# EAGLE design PCB Design (EAGLE 8.6.3)

## Sheet 1 of 3
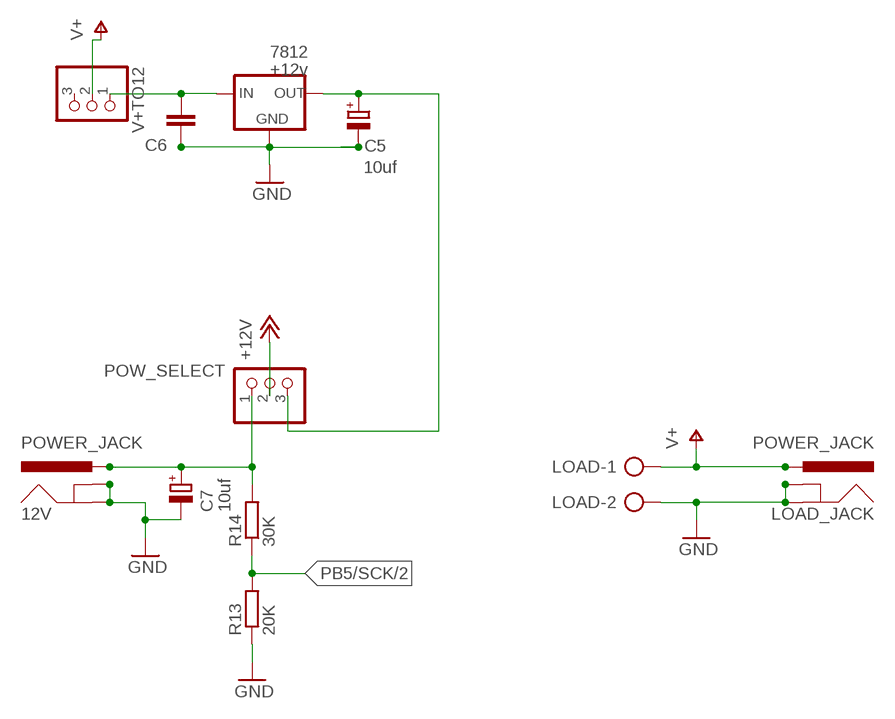
[diagram p0: schematic, sheet 1]

### Parts
12V  POWER_JACK  [POWER_JACK_PTH]
7812  +12v  V_REG_78XX7812  [TO-252]
C5  10uf  CPOL-EUE2.5-6  [E2,5-6]
C6  .1uF  C-EUC0805K  [C0805K]
C7  10uf  CPOL-EUE2.5-6  [E2,5-6]
LOAD  AK500/2-H  [AK500/2-H]
LOAD_JACK  POWER_JACK  [POWER_JACK_PTH]
POW_SELECT  PINHD-1X3  [1X03]
R13  20K  R-EU_M0805  [M0805]
R14  30K  R-EU_M0805  [M0805]
V+TO12  PINHD-1X3  [1X03]

### Nets
12V_JACK_INPUT: 12V.PWR C7.+ POW_SELECT.1 R14.2
12V_REG_O/P: 7812.2(OUT) C5.+ POW_SELECT.3
+12V: POW_SELECT.2 ; also sheet 2
GND: 12V.GND 12V.GNDBREAK 7812.3(GND) C5.- C6.2 C7.- LOAD.2 LOAD_JACK.GND LOAD_JACK.GNDBREAK R13.1 ; also sheet 2,3
N$2: 7812.1(IN) C6.1 V+TO12.1
PB5/SCK: R13.2 R14.1 ; also sheet 2
V+: LOAD.1 LOAD_JACK.PWR V+TO12.2
Unconnected: V+TO12.3

## Sheet 2 of 3
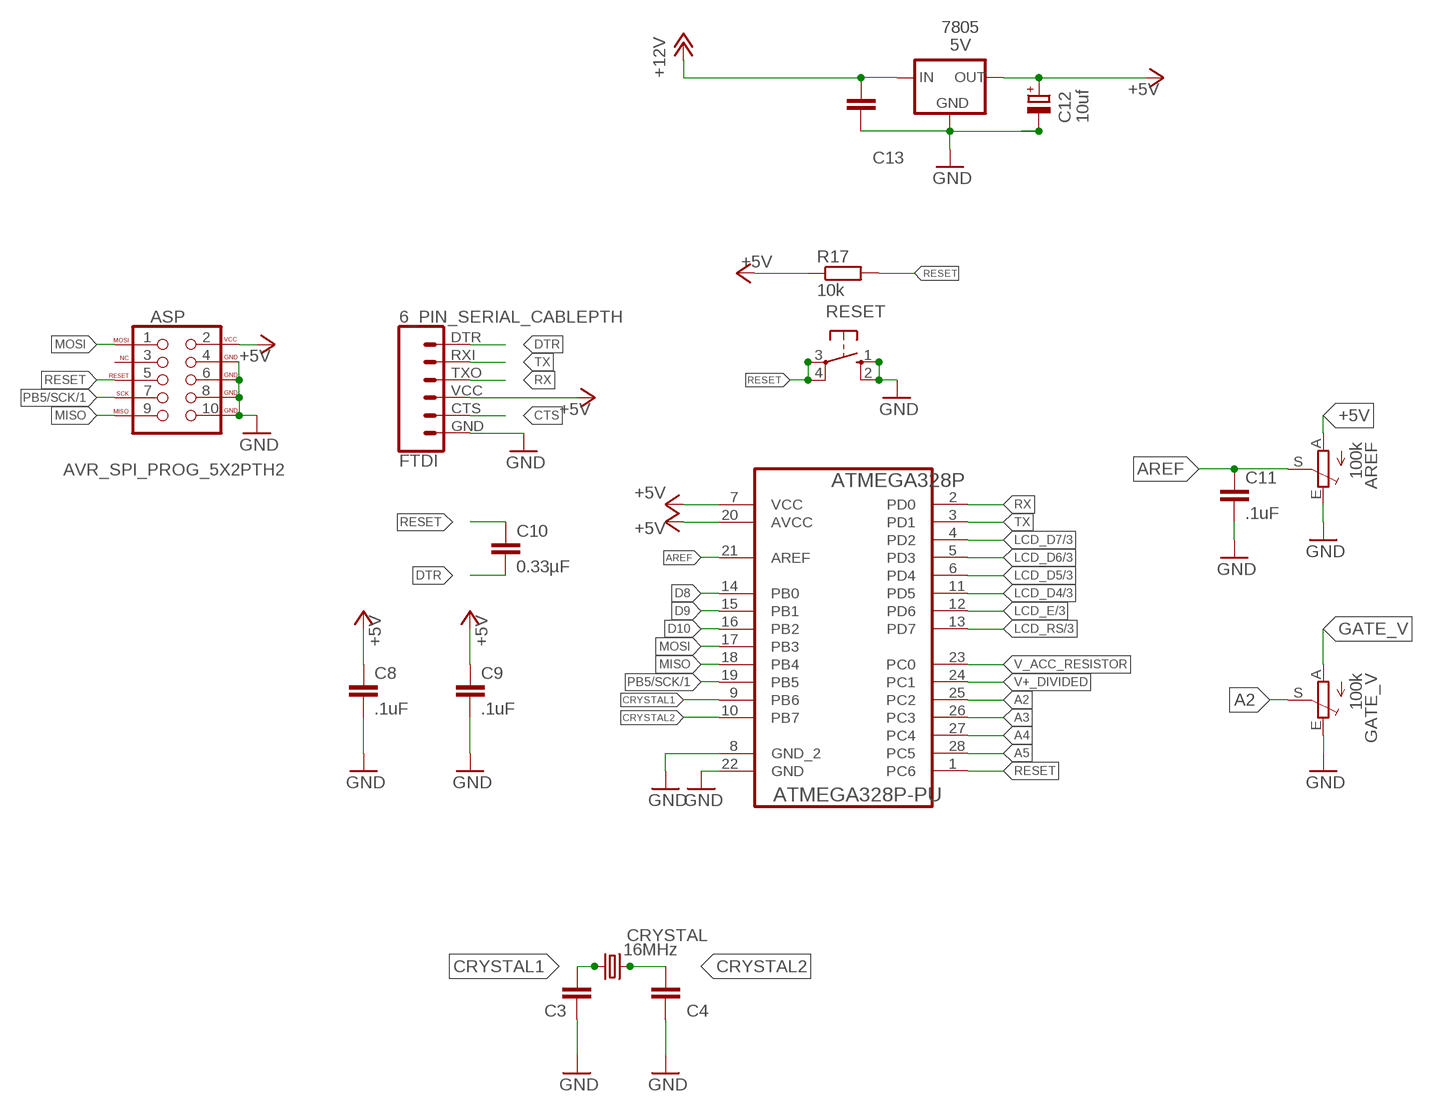
[diagram p1: schematic, sheet 2]

### Parts
7805  5V  V_REG_78XX7812  [TO-252]
AREF  100k  TRIM_EU-S64W  [S64W]
ASP  AVR_SPI_PROG_5X2PTH2  [2X5-SHROUDED]
ATMEGA328P  ATMEGA328P-PU  [DIP254P762X457-28]
C3  22pF  C-EUC0805K  [C0805K]
C4  22pF  C-EUC0805K  [C0805K]
C8  .1uF  C-EUC0805K  [C0805K]
C9  .1uF  C-EUC0805K  [C0805K]
C10  0.33µF  C-EUC0805K  [C0805K]
C11  .1uF  C-EUC0805K  [C0805K]
C12  10uf  CPOL-EUE2.5-6  [E2,5-6]
C13  .1uf  C-EUC0805K  [C0805K]
CRYSTAL  16MHz  CRYSTALHC49U70  [HC49U70]
FTDI  6_PIN_SERIAL_CABLEPTH  [FTDI_BASIC]
GATE_V  100k  TRIM_EU-S64W  [S64W]
R17  10k  R-EU_M0805  [M0805]
RESET  10-XX  [B3F-10XX]

### Nets
+5V: 7805.2(OUT) AREF.A ASP.2(VCC) ATMEGA328P.7(VCC) ATMEGA328P.20(AVCC) C8.1 C9.1 C12.+ FTDI.VCC R17.1 ; also sheet 3
+12V: 7805.1(IN) C13.1 ; also sheet 1
A2: ATMEGA328P.25(PC2) GATE_V.S
A3: ATMEGA328P.26(PC3)
A4: ATMEGA328P.27(PC4)
A5: ATMEGA328P.28(PC5)
AREF: AREF.S ATMEGA328P.21(AREF) C11.1
CRYSTAL1: ATMEGA328P.9(PB6) C3.2 CRYSTAL.1
CRYSTAL2: ATMEGA328P.10(PB7) C4.2 CRYSTAL.2
CTS: FTDI.CTS
D8: ATMEGA328P.14(PB0)
D9: ATMEGA328P.15(PB1)
D10: ATMEGA328P.16(PB2)
DTR: C10.2 FTDI.DTR
GATE_V: GATE_V.A
GND: 7805.3(GND) AREF.E ASP.4(GND) ASP.6(GND) ASP.8(GND) ASP.10(GND) ATMEGA328P.8(GND_2) ATMEGA328P.22(GND) C3.1 C4.1 C8.2 C9.2 C11.2 C12.- C13.2 FTDI.GND GATE_V.E RESET.1(S) RESET.2(S1) ; also sheet 1,3
LCD_D4: ATMEGA328P.11(PD5) ; also sheet 3
LCD_D5: ATMEGA328P.6(PD4) ; also sheet 3
LCD_D6: ATMEGA328P.5(PD3) ; also sheet 3
LCD_D7: ATMEGA328P.4(PD2) ; also sheet 3
LCD_E: ATMEGA328P.12(PD6) ; also sheet 3
LCD_RS: ATMEGA328P.13(PD7) ; also sheet 3
MISO: ASP.9(MISO) ATMEGA328P.18(PB4)
MOSI: ASP.1(MOSI) ATMEGA328P.17(PB3)
PB5/SCK: ASP.7(SCK) ATMEGA328P.19(PB5) ; also sheet 1
RESET: ASP.5(RESET) ATMEGA328P.1(PC6) C10.1 R17.2 RESET.3(P) RESET.4(P1)
RX: ATMEGA328P.2(PD0) FTDI.TXO
TX: ATMEGA328P.3(PD1) FTDI.RXI
V+_DIVIDED: ATMEGA328P.24(PC1)
V_ACC_RESISTOR: ATMEGA328P.23(PC0)
Unconnected: ASP.3(NC)

## Sheet 3 of 3
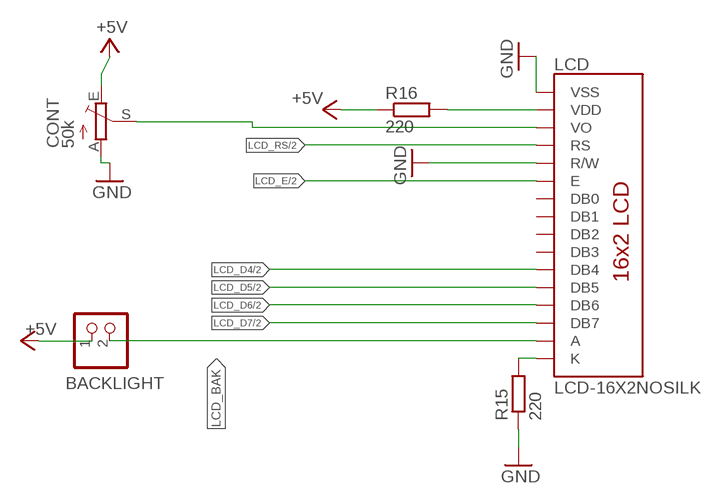
[diagram p2: schematic, sheet 3]

### Parts
BACKLIGHT  PINHD-1X2  [1X02]
CONT  50k  TRIM_EU-S64W  [S64W]
LCD  LCD-16X2NOSILK  [LCD-16X2_NOSILK]
R15  220  R-EU_M0805  [M0805]
R16  220  R-EU_M0805  [M0805]

### Nets
+5V: BACKLIGHT.1 CONT.E R16.1 ; also sheet 2
GND: CONT.A LCD.1(VSS) LCD.5(R/W) R15.1 ; also sheet 1,2
LCD_BAK: BACKLIGHT.2 LCD.15(A)
LCD_D4: LCD.11(DB4) ; also sheet 2
LCD_D5: LCD.12(DB5) ; also sheet 2
LCD_D6: LCD.13(DB6) ; also sheet 2
LCD_D7: LCD.14(DB7) ; also sheet 2
LCD_E: LCD.6(E) ; also sheet 2
LCD_RS: LCD.4(RS) ; also sheet 2
N$6: CONT.S LCD.3(VO)
N$7: LCD.2(VDD) R16.2
N$14: LCD.16(K) R15.2
Unconnected: LCD.7(DB0) LCD.8(DB1) LCD.9(DB2) LCD.10(DB3)

## Library data of the parts
12V LOAD_JACK = SparkFun-Connectors:POWER_JACK: Power Jack Connector This is the standard 5.5mm barrel jack for power. The PTH is the most common, proven, reliable, footprint. The Slot footprint only works if the mill layer is transmitted to the PCB fab house so be warned. Here are the connectors we sell at SparkFun: DC Barrel Power Jack/Connector <https://www.sparkfun.com/products/119> (PRT-00119) DC Barrel Power Jack/Connector (SMD) <https://www.sparkfun.com/products/12748> (PRT-12748) DC Barrel Jack Adapter - Breadboard Compatible <https://www.sparkfun.com/products/10811> (PRT-10811) It is used on this SparkFun product (and many, many others): SparkFun RedBoard - Programmed with Arduino <https://www.sparkfun.com/products/12757> (DEV-12757) Also, if you need a mating power supply or connector, please check these out: Wall Adapter Power Supply - 9VDC 650mA <https://www.sparkfun.com/products/298> (TOL-00298) DC Barrel Jack Adapter - Male <https://www.sparkfun.com/products/10287> (PRT-10287); PROD_ID: CONN-08197
7805 = SparkFun-IC-Power:V_REG_78XX: Voltage Regulator Standard 78xx regulator. IGO (Input Ground Output). Spark Fun Electronics SKU : COM-00107; PROD_ID: VREG-12370; VALUE: +12v
7812 = SparkFun-IC-Power:V_REG_78XX: Voltage Regulator Standard 78xx regulator. IGO (Input Ground Output). Spark Fun Electronics SKU : COM-00107; PROD_ID: VREG-12370
AREF CONT GATE_V = pot:TRIM_EU-: POTENTIOMETER
ASP = SparkFun-Connectors:AVR_SPI_PROG_5X2: AVR 10-pin ICSP Header This is the standard AVR In Circuit Serial Programming header. Minimal, but includes pin one indicator. Works with standard Olimex programmers. SparkFun Products: 2x5 AVR ICSP Male Header <https://www.sparkfun.com/products/778> - PTH 2x5 Pin Shrouded Header <https://www.sparkfun.com/products/8506> - PTH2; PROD_ID: CONN-08671; SF_ID: PRT-08506
ATMEGA328P = Atmel_By_element14_Batch_1-00:ATMEGA328P-PU: 8-bit Microcontroller with In-System Programmable Flash; MPN: ATMEGA328P-PU; OC_FARNELL: 1715487; OC_NEWARK: 15R0268; PACKAGE: PDIP-28; SUPPLIER: Atmel
BACKLIGHT = pinhead:PINHD-1X2: PIN HEADER
C3 C4 C6 C8-C11 C13 = rcl:C-EU: CAPACITOR, European symbol
C5 C7 C12 = resistor:CPOL-EU: POLARIZED CAPACITOR, European symbol
CRYSTAL = crystal:CRYSTAL: CRYSTAL; OC_FARNELL: unknown; OC_NEWARK: unknown
FTDI = SparkFun-Connectors:6_PIN_SERIAL_CABLE: 6-pin header connection for use with the "FTDI BASIC" pinout - CABLE SIDE. Also known as "Arduino Serial Program Header". This is used on a design to provide a 6-pin connection point for serial communication usually from a USB cable (D+/D-) to these headers (RX/TX). It also has the remaining pins necessary for programming in the Arduino evironment (DTR, GND, and sometimes VCC). Note, this device has "CABLE" in the name. It is intended to be used on a design that usually lives on the end of your USB cable and prvides the converter chip (FTDI232 or FTDI231x) to commnicate serial RX/TX. The "sister" device, named "TARGET" is inteneded to be used on a design that contains a target micro-controller that you wish to program. You can populate with some of these: Female Headers <https://www.sparkfun.com/products/115> (PRT-00115) For reference (or to suit your programming needs) check out these designs: SparkFun FTDI Basic Breakout - 5V <https://www.sparkfun.com/products/9716> (DEV-09716) SparkFun FTDI Basic Breakout - 3.3V <https://www.sparkfun.com/products/9873> (DEV-09873) SparkFun FTDI SmartBasic <https://www.sparkfun.com/products/12935> (DEV-12935) SparkFun Beefy 3 - FTDI Basic Breakout <https://www.sparkfun.com/products/13746> (DEV-13746)
LCD = SparkFun-Displays:LCD-16X2: Standard text-only 16x2 parallel input LCD Basic 16 character by 2 line display. Typically utilizes the extremely common HD44780 parallel interface chipset SparkFun Products: Basic 16x2 Green <https://www.sparkfun.com/products/255> Basic 8x2 Green <https://www.sparkfun.com/products/11122>; SF_ID: LCD-00255
LOAD = con-ptr500:AK500/2-H: CONNECTOR Aug. 2004 / PTR Meßtechnik: Die Bezeichnung der Serie AK505 wurde geändert. Es handelt sich hierbei um AK500 in horizontaler Ausführung.; OC_FARNELL: unknown; OC_NEWARK: unknown
POW_SELECT V+TO12 = pinhead:PINHD-1X3: PIN HEADER
R13-R17 = resistor:R-EU_: RESISTOR, European symbol
RESET = switch-omron:10-XX: OMRON SWITCH; MPN: B3F-1000; OC_FARNELL: 176432; OC_NEWARK: 36M3542

## Board
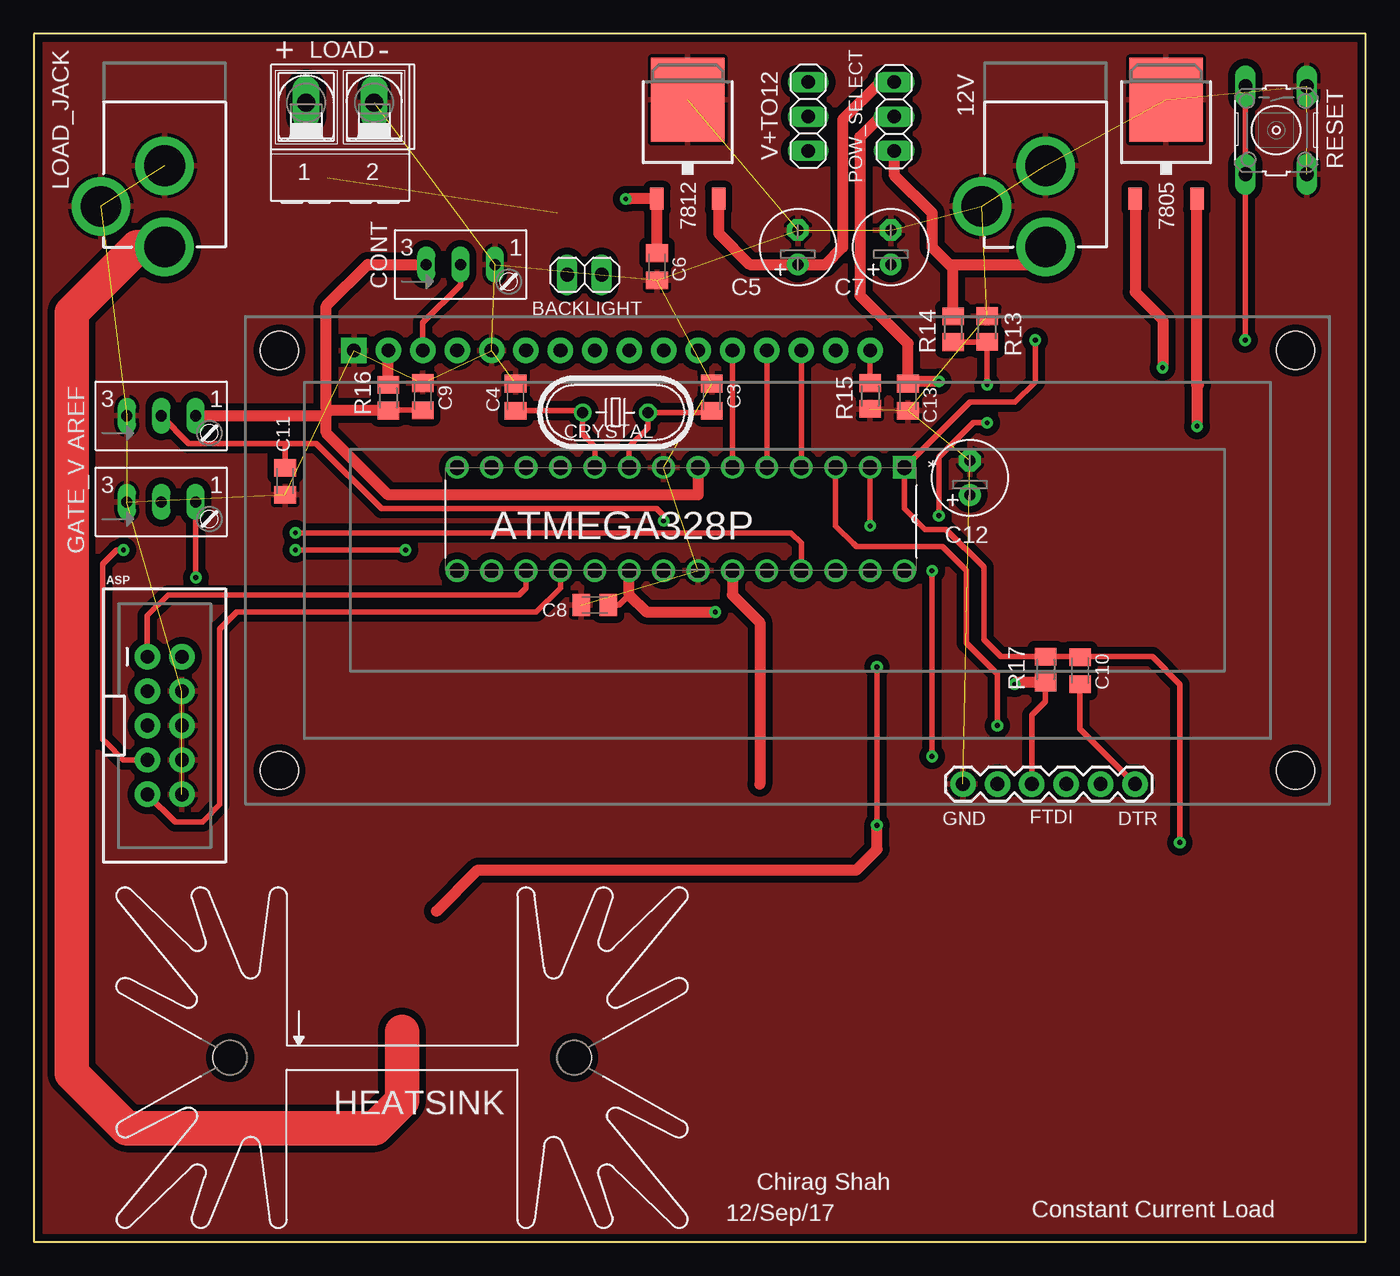
[diagram p3: board, top side]
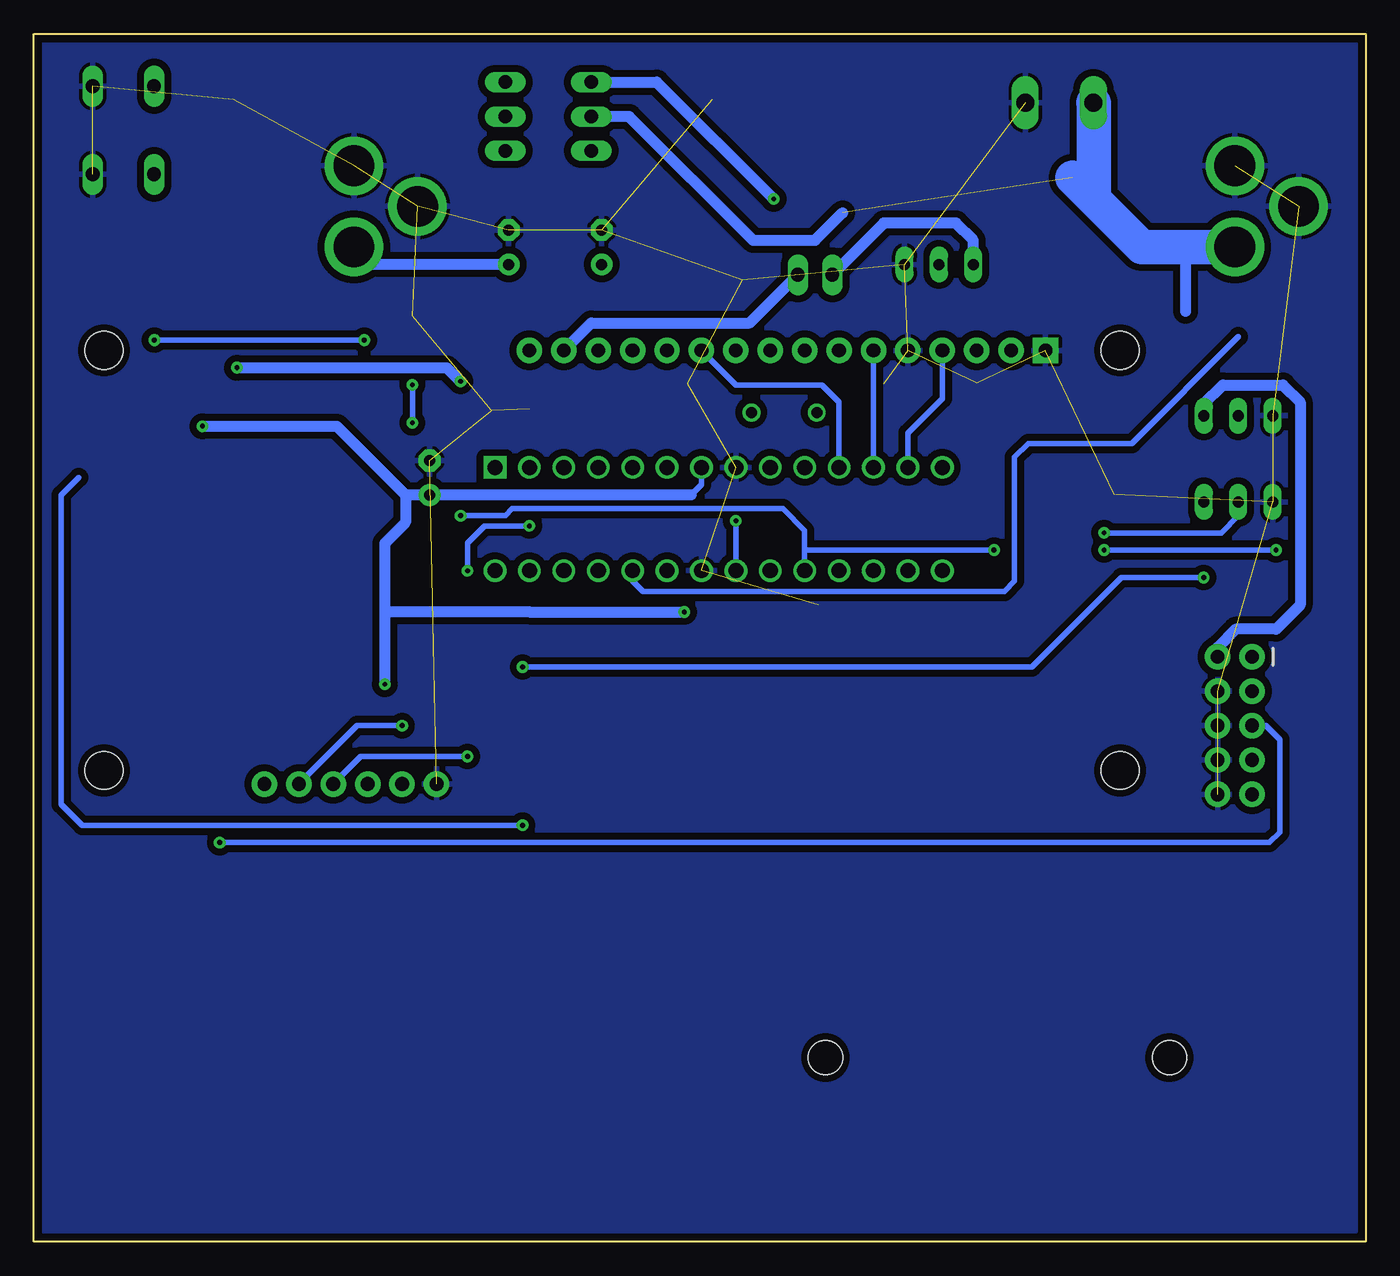
[diagram p4: board, bottom side, seen from below]

Size 98.3 x 89.15 mm. Coordinates in mm from the lower left corner, seen from the top.
Outline: 0,89.15 0,0 98.3,0 98.3,89.15 0,89.15
Copper layers (1*16): Top 0.035mm / dielectric 1.5mm / Bottom 0.035mm
Design rules "SparkFun-2-layer-STANDARD *": minimum track width 10mil, minimum drill 0.35mm, track to track 10mil, track to pad 8mil, pad to pad 8mil, via to via 10mil, smd to smd 8mil, copper to edge 8mil, drill to drill 8mil, minimum pad ring 10mil, minimum via ring 10mil, stop-mask expansion 4mil, vias tented up to drill 25mil, thermal gap 10mil

### Footprints (pad centres in the part's own frame; a part is rotated, then mirrored left to right if it is on the bottom)
POWER_JACK_PTH = drill 2.997 pad 4.318: GND 0,7.7; GNDBREAK 4.7,10.7; PWR 0,13.7
TO-252 = smd 1 x 1.6: 1 -2.28,-4.8; 2 2.28,-4.8 | smd 5.4 x 6.2: 3 0,2.5
S64W = drill 0.813 long: A 2.54,1.27; E -2.54,1.27; S 0,1.27
2X5-SHROUDED = drill 1.016 pad 1.88: 1 -1.27,5.08; 2 1.27,5.08; 3 -1.27,2.54; 4 1.27,2.54; 5 -1.27,0; 6 1.27,0; 7 -1.27,-2.54; 8 1.27,-2.54; 9 -1.27,-5.08; 10 1.27,-5.08
DIP254P762X457-28 = drill 1.118 square: 1 -7.62,33.02 | drill 1.118: 2 -7.62,30.48; 3 -7.62,27.94; 4 -7.62,25.4; 5 -7.62,22.86; 6 -7.62,20.32; 7 -7.62,17.78; 8 -7.62,15.24; 9 -7.62,12.7; 10 -7.62,10.16; 11 -7.62,7.62; 12 -7.62,5.08; 13 -7.62,2.54; 14 -7.62,0; 15 0,0; 16 0,2.54; 17 0,5.08; 18 0,7.62; 19 0,10.16; 20 0,12.7; 21 0,15.24; 22 0,17.78; 23 0,20.32; 24 0,22.86; 25 0,25.4; 26 0,27.94; 27 0,30.48; 28 0,33.02
1X02 = drill 1.016 long: 1 -1.27,0; 2 1.27,0
C0805K = smd 1.3 x 1.6: 1 -1,0; 2 1,0
E2,5-6 = drill 0.813 pad 1.6: + -1.27,0 | drill 0.813 pad 1.6 octagon: - 1.27,0
HC49U70 = drill 0.813: 1 -2.413,0; 2 2.413,0
FTDI_BASIC = drill 1.016 pad 1.88: CTS 10.16,0; DTR 0,0; GND 12.7,0; RXI 2.54,0; TXO 5.08,0; VCC 7.62,0
SK129-HOLE = hole 2.54: -12.7,-0.889; 12.7,-0.889
LCD-16X2_NOSILK = drill 1.016 pad 1.88 square: 1 -32,15.5 | drill 1.016 pad 1.88: 2 -29.46,15.5; 3 -26.92,15.5; 4 -24.38,15.5; 5 -21.84,15.5; 6 -19.3,15.5; 7 -16.76,15.5; 8 -14.22,15.5; 9 -11.68,15.5; 10 -9.14,15.5; 11 -6.6,15.5; 12 -4.06,15.5; 13 -1.52,15.5; 14 1.02,15.5; 15 3.56,15.5; 16 6.1,15.5 | hole 2.8: -37.5,15.5; -37.5,-15.5; 37.5,15.5; 37.5,-15.5
AK500/2-H = drill 1.321 long: 1 -2.515,0; 2 2.515,0
1X03 = drill 1.016 long: 1 -2.54,0; 2 0,0; 3 2.54,0
M0805 = smd 1.3 x 1.6: 1 -0.95,0; 2 0.95,0
B3F-10XX = drill 1.016 long: 1 -3.251,2.261; 2 3.251,2.261; 3 -3.251,-2.261; 4 3.251,-2.261

### Placement (x,y rotation side)
12V  74.68,87.12 180 top
7805  83.57,81.79 0 top
7812  48.26,81.79 0 top
AREF  9.4,59.69 0 top
ASP  9.65,38.1 0 top
ATMEGA328P  31.24,49.53 270 top
BACKLIGHT  40.64,71.37 0 top
C3  50.04,62.34 270 top
C4  35.56,62.34 270 top
C5  56.39,73.41 90 top
C6  46,71.97 270 top
C7  63.25,73.41 90 top
C8  41.4,46.99 180 top
C9  28.7,62.37 90 top
C10  77.22,42.15 270 top
C11  18.54,56.13 270 top
C12  69.09,56.39 90 top
C13  64.52,62.34 270 top
CONT  31.5,70.87 0 top
CRYSTAL  42.93,61.21 180 top
FTDI  81.28,33.78 180 top
GATE_V  9.4,53.34 0 top
HEATSINK  [SK129-HOLE]  27.18,14.48 0 top
LCD  55.63,50.29 0 top
LOAD  22.61,84.07 0 top
LOAD_JACK  9.65,87.12 180 top
POW_SELECT  63.5,83.06 90 top
R13  70.36,67.37 270 top
R14  67.84,67.35 90 top
R15  61.72,62.42 90 top
R16  26.16,62.3 90 top
R17  74.68,42.23 90 top
RESET  91.69,82.04 270 top
V+TO12  57.15,83.06 270 top

### Tracks (layer width: path | path; a pad name or v marks a point on that pad's centre or on a via)
12V_JACK_INPUT
  Top 0.813: POW_SELECT.1 63.5,78.74 66.29,75.95 66.29,73.41 67.56,72.14 | 67.56,72.14 73.39,72.14 12V.PWR | R14.2 67.84,71.86 67.56,72.14
  Bottom 0.813: C7.+ 73.39,72.14 12V.PWR
12V_REG_O/P
  Top 0.813: 7812.2 50.54,74.43 52.83,72.14 C5.+ 58.42,72.14 59.69,73.41 59.69,82.8 62.48,85.6 POW_SELECT.3
+5V  (via drill 0.35)
  Top 0.406: 49.01,55.12 49.02,55.13 | R17.1 74.61,41.28 74.68,41.22 74.68,39.88 73.66,38.86 FTDI.VCC | 21.53,60.96 21.59,61.02 21.59,61.47 21.71,61.35 | C9.1 26.19,61.37 R16.1 | C8.1 43.18,46.99 43.94,47.75
  Top 0.813: ATMEGA328P.7 49.02,55.13 | 49.01,55.12 26.16,55.12 21.59,59.69 21.59,61.02 | 74.61,41.28 72.52,41.28 v72.39,41.15 | CONT.E 24.64,72.14 21.59,69.09 21.59,61.47 | ATMEGA328P.20 43.94,47.75 45.21,46.48 v50.29,46.48 | AREF.A 21.53,60.96 | R16.1 21.71,61.35 | 85.85,63.12 7805.2 | 85.85,63.12 v85.85,60.2 | 85.97,63.25 85.85,63.12
  Bottom 0.406: ATMEGA328P.7 49.02,55.88 49.78,55.12 | 61.72,46.47 61.74,46.48
  Bottom 0.813: 49.78,55.12 C12.+ 70.87,55.12 | 70.87,55.12 75.95,60.2 v85.85,60.2 | 70.87,55.12 70.87,53.09 72.39,51.56 72.39,46.48 | v50.29,46.48 61.74,46.48 72.39,46.48 | v72.39,41.15 72.39,46.48 | AREF.A 11.94,61.85 10.54,63.25 6.1,63.25 4.83,61.98 4.83,46.99 6.6,45.21 9.59,45.21 10.92,43.88 ASP.2 | CONT.E 28.96,73.91 30.23,75.18 35.56,75.18 BACKLIGHT.1
+12V  (via drill 0.35)
  Top 0.406: C13.1 64.52,63.44 64.57,63.5
  Top 0.813: 64.52,63.44 64.52,66.29 60.96,69.85 60.96,81.53 62.48,83.06 POW_SELECT.2 | v66.8,63.5 64.57,63.5 | 7805.1 81.29,70.1 83.31,68.07 v83.31,64.52
  Bottom 0.813: v66.8,63.5 67.82,64.52 v83.31,64.52
A2  (via drill 0.35)
  Top 0.406: v19.3,52.32 55.88,52.32 56.64,51.56 ATMEGA328P.25
  Bottom 0.406: GATE_V.S 9.4,53.59 10.67,52.32 v19.3,52.32
AREF  (via drill 0.35)
  Top 0.406: v46.48,53.21 46.48,53.59 45.97,54.1 25.65,54.1 20.83,58.93 18.54,58.93 | AREF.S 11.43,58.93 18.54,58.93 | C11.1 18.54,58.92 18.54,58.93
  Bottom 0.406: ATMEGA328P.21 v46.48,53.21
CRYSTAL1
  Top 0.406: ATMEGA328P.9 43.94,58.67 45.34,60.07 CRYSTAL.1 49.91,61.21 C3.2
CRYSTAL2
  Top 0.406: ATMEGA328P.10 41.4,58.67 40.51,59.56 CRYSTAL.2 40.39,61.34 C4.2
DTR
  Top 0.406: C10.2 77.22,37.85 FTDI.DTR
GATE_V  (via drill 0.35)
  Top 0.406: GATE_V.A 11.95,54.6 v11.95,49.02 | v62.23,30.73 v62.23,42.42
  Top 0.813: 29.72,24.38 32.77,27.43 60.71,27.43 62.23,28.96 v62.23,30.73
  Bottom 0.406: v11.95,49.02 18.03,49.02 24.64,42.42 59.25,42.42 59.69,42.42 v62.23,42.42 | 95,56.39 96.27,55.12 96.27,32.26 94.74,30.73 v62.23,30.73
GND  (32 unrouted)
  pour Bottom (isolate 0.508): 0.76,88.39 97.54,88.39 97.54,0.76 0.76,0.76
  pour Top (isolate 0.508): 0.76,88.39 97.54,88.39 97.54,0.76 0.76,0.76
LCD_BAK
  Bottom 0.813: LCD.15 57.16,67.82 45.47,67.82 BACKLIGHT.2
LCD_D4
  Bottom 0.406: ATMEGA328P.11 38.86,61.98 40.13,63.25 46.48,63.25 LCD.11
LCD_D5
  Top 0.305: LCD.12
  Top 0.406: ATMEGA328P.6 LCD.12
LCD_D6
  Top 0.305: LCD.13
  Top 0.406: ATMEGA328P.5 LCD.13
LCD_D7
  Top 0.305: LCD.14
  Top 0.406: ATMEGA328P.4 LCD.14
LCD_E
  Bottom 0.406: LCD.6 ATMEGA328P.12
LCD_RS
  Bottom 0.406: ATMEGA328P.13 33.78,59.69 31.24,62.23 LCD.4
MISO
  Top 0.406: ASP.9 10.41,30.99 12.45,30.99 13.72,32.26 13.72,45.21 14.99,46.48 37.08,46.48 38.86,48.26 ATMEGA328P.18
MOSI
  Top 0.406: ATMEGA328P.17 36.32,48.26 35.81,47.75 9.91,47.75 8.38,46.23 ASP.1
N$2  (via drill 0.35)
  Top 0.406: 46,76.97 7812.1 | 43.97,76.99 43.94,76.96 v43.69,76.96
  Top 0.813: C6.1 46,76.97 | 7812.1 43.97,76.99
  Bottom 0.813: V+TO12.1 52.32,85.6 v43.69,76.96
N$6
  Top 0.406: LCD.3 28.71,67.82 31.5,70.61 CONT.S
N$7
  Top 0.406: LCD.2
  Top 0.813: R16.2 LCD.2
N$14
  Top 0.406: R15.2 LCD.16
PB5/SCK  (via drill 0.35, 0.35 pad 0.7)
  Top 0.406: R14.1 70.34,66.4 R13.2 v70.36,63.25 | v70.36,60.45 69.34,60.45 66.8,57.91 v66.8,53.59 | ASP.7 6.6,35.56 5.33,36.84 | 5.33,36.84 5.08,37.08 | v27.43,51.05 v19.3,51.05 | v6.6,51.05 6.1,51.05 5.08,50.04 5.08,37.08 | 5.08,37.08 5.33,36.84
  Bottom 0.406: 41.4,51.05 ATMEGA328P.19 | 41.4,51.05 41.4,52.51 42.99,54.1 62.99,54.1 63.5,53.59 v66.8,53.59 | v70.36,63.25 v70.36,60.45 | v27.43,51.05 41.4,51.05 | v19.3,51.05 v6.6,51.05
RESET  (via drill 0.35)
  Top 0.406: RESET.3 RESET.4 89.41,78.77 v89.41,66.55 | v84.58,29.46 84.58,41.15 82.55,43.18 77.25,43.18 C10.1 77.18,43.18 R17.2 71.37,43.18 70.1,44.45 70.1,49.78 67.31,52.58 65.79,52.58 64.26,54.1 ATMEGA328P.1 69.09,61.98 72.42,61.98 73.91,63.47 v73.91,66.55
  Bottom 0.406: ASP.5 7.37,38.1 6.35,37.08 6.35,30.23 7.11,29.46 v84.58,29.46 | v73.91,66.55 v89.41,66.55
RX  (via drill 0.35)
  Top 0.406: v61.72,52.83 ATMEGA328P.2 | v66.29,49.53 v66.29,35.81
  Bottom 0.406: v61.72,52.83 65.02,52.83 66.29,51.56 v66.29,49.53 | v66.29,35.81 74.17,35.81 FTDI.TXO
TX  (via drill 0.35)
  Top 0.406: 60.49,51.53 59.18,52.83 ATMEGA328P.3 | 60.49,51.53 60.71,51.31 | v71.12,38.1 71.12,41.91 68.83,44.2 68.83,49.53 67.06,51.31 60.71,51.31 | 60.71,51.31 60.49,51.53
  Bottom 0.406: v71.12,38.1 74.42,38.1 FTDI.RXI
V+  (1 unrouted)
  Top 2.54: 27.18,15.49 27.18,10.41 25.15,8.38 6.86,8.38 2.79,12.45 2.79,68.58 7.64,73.42 LOAD_JACK.PWR
  Bottom 0.813: V+TO12.2 54.36,83.06 45.21,73.91 40.64,73.91 38.61,75.95 | 13.29,68.66 13.29,73.42
  Bottom 2.54: LOAD_JACK.PWR 13.29,73.42 16.53,73.42 20.07,76.96 | 20.07,76.96 20.07,84.05 LOAD.1 | 21.63,78.53 20.07,76.96
V+_DIVIDED
  Bottom 0.406: 9.4,66.8 17.27,58.93 24.89,58.93 25.91,57.91 25.91,48.77 26.67,48.01 28.19,48.01 | ATMEGA328P.24 54.1,48.77 53.34,48.01 28.19,48.01 | 27.94,48.01 28.19,48.01
V_ACC_RESISTOR
  Top 0.813: ATMEGA328P.23 51.56,47.75 53.59,45.72 53.59,33.78

### Text on the board
tNames: + | - | GND | DTR | Chirag Shah | 12/Sep/17 | Constant Current Load